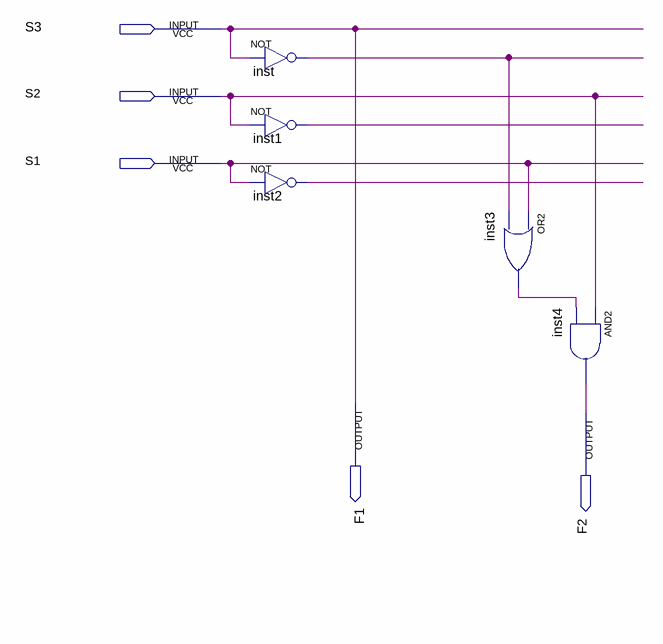
[diagram p0: schematic sheet]
// Quartus schematic decodificador_saida.bdf as structural Verilog: 5 symbols, 5 pins
module decodificador_saida (
  input  S3,
  input  S2,
  input  S1,
  output F1,
  output F2
);

  wire inst1_out, inst2_out, inst3_out, inst_out;

  not inst (inst_out, S3);
  not inst1 (inst1_out, S2);
  not inst2 (inst2_out, S1);
  or inst3 (inst3_out, S1, inst_out);
  and inst4 (F2, S2, inst3_out);

  assign F1 = S3;
endmodule
